# Altium project LV-BMS_21_V2.PrjPcb
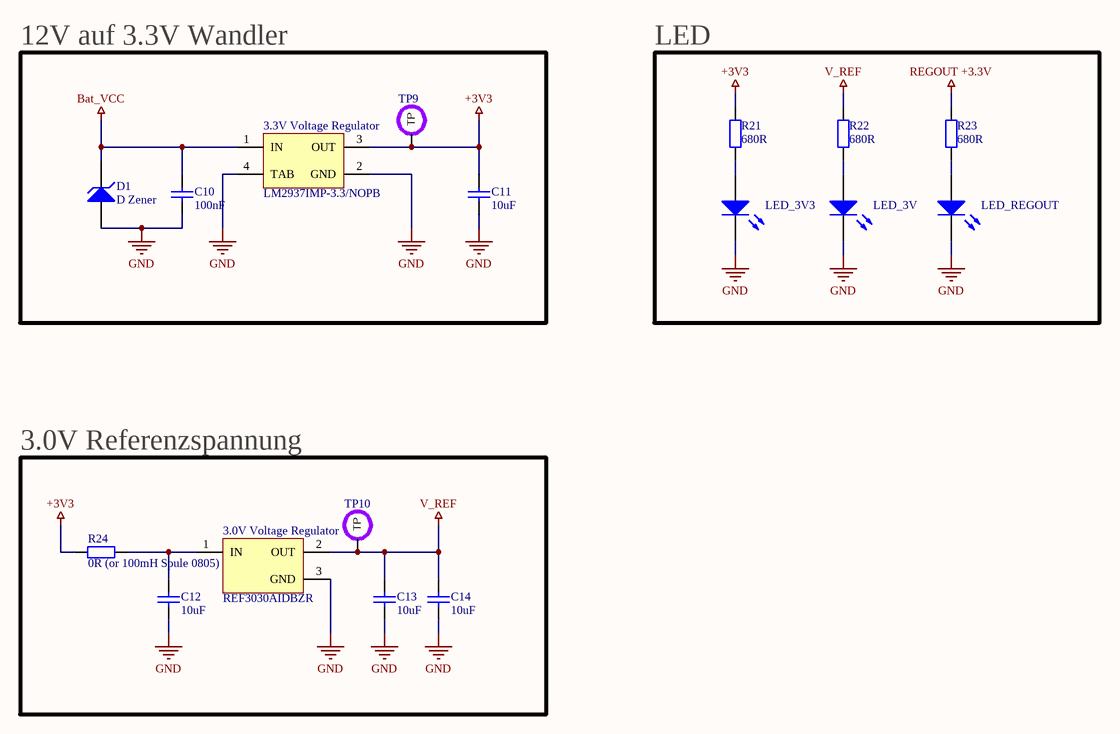
[diagram p0: Power_Supply Voltage.SchDoc]
4 sheets, 163 parts. Net scope: flat (ports and power ports of the same name join across sheets).
Board file: LV-BMS_V2_21E.PcbDoc
Sheets:
  Power_Supply Voltage.SchDoc
  Eingang_Ausgang Signal.SchDoc
  uC.SchDoc
  AFE_BQ-Chip.SchDoc

## Sheet Power_Supply Voltage.SchDoc
size A4

### Parts
3.0V_Voltage_Regulator  REF3030AIDBZR  [DBZ0003A_L]
3.3V_Voltage_Regulator  LM2937IMP-3.3/NOPB  [DCY0004A_M]
C10  100nF  [C1206]
C11  10uF  [1608[0603]]
C12  10uF  [1608[0603]]
C13  10uF  [1608[0603]]
C14  10uF  [1608[0603]]
D1  D Zener  [SMB]
LED_3V  LED_3V  [1608[0603]]  (value not drawn)
LED_3V3  LED_3V3  [1608[0603]]  (value not drawn)
LED_REGOUT  LED_3V  [1608[0603]]  (value not drawn)
R21  680R  [J1-0603]
R22  680R  [J1-0603]
R23  680R  [J1-0603]
R24  0R (or 100mH Spule 0805)  [J1-0603]
TP9  TP_1  [Test point]  (value not drawn)  (no BOM)
TP10  TP_1  [Test point]  (value not drawn)  (no BOM)

### Blocks framed on the sheet
12V auf 3.3V Wandler: 3.3V_Voltage_Regulator C10 C11 D1 TP9
LED: LED_3V LED_3V3 LED_REGOUT R21-R23
3.0V Referenzspannung: 3.0V_Voltage_Regulator C12-C14 R24 TP10

### Nets
+3V3: 3.3V_Voltage_Regulator.3(OUT) C11.2 R21.1 R24.2 TP9.1(TP)
Bat_VCC: 3.3V_Voltage_Regulator.1(IN) C10.2 D1.2(K)
GND: 3.0V_Voltage_Regulator.3(GND) 3.3V_Voltage_Regulator.2(GND) 3.3V_Voltage_Regulator.4(TAB) C10.1 C11.1 C12.1 C13.1 C14.1 D1.1(A) LED_3V.2(K) LED_3V3.2(K) LED_REGOUT.2(K)
REGOUT +3.3V: R23.1
V_REF: 3.0V_Voltage_Regulator.2(OUT) C13.2 C14.2 R22.1 TP10.1(TP)
Net3.0V_Voltage_Regulator_1: 3.0V_Voltage_Regulator.1(IN) C12.2 R24.1
NetLED_3V3_1: LED_3V3.1(A) R21.2
NetLED_3V_1: LED_3V.1(A) R22.2
NetLED_REGOUT_1: LED_REGOUT.1(A) R23.2

### Library data of the parts
3.0V_Voltage_Regulator = CMP-0367-00154-2: 3.0 V, 50 ppm / degC, 50 uA Series (Bandgap) Voltage Reference, -40 to 125 degC, 3-pin SOT-23 (DBZ), Green (RoHS & no Sb/Br); Manufacturer: Texas Instruments; SubFamily: Series Voltage Reference; Temp Coeff(Typ)(ppm/ degree C): 20; Temp Coeff(Max)(ppm/ degree C): 50; Rating: Catalog; ComponentLink2URL: http://www.ti.com/general/docs/lit/getliterature.tsp?genericPartNumber=REF3030&fileType=pdf; DatasheetVersion: SBVS032F; PackageReference: DBZ0003A; PackageDescription: 3-Pin Plastic Small Outline, Body 2.92 x 1.3 mm, Pitch 0.95 mm; ComponentLink1URL: http://www.ti.com/; ComponentLink3Description: Package Specification; PackageVersion: 4203227/B; PartNumber: REF3030AIDBZR; Mounting Technology: Surface Mount; ComponentLink2Description: Datasheet; ComponentLink3URL: http://www.ti.com/litv/pdf/mpds108a; ComponentLink1Description: Manufacturer URL; Code_JEDEC: TO-236; Eco-Plan: Green (RoHS & no Sb/Br)
3.3V_Voltage_Regulator = CMP-0062-01754-3: 400mA and 500mA Voltage Regulator, 4-pin SOT-223, Pb-Free; Manufacturer: Texas Instruments; CompType: LDO IC; PowerWise: N; PackageTopMarking: XYTT*L69B; PackageReference: DCY0004A; PackageDescription: Molded SOT-223, 6.50 x 3.56 x 1.6mm Body, 4 Lead, 2.3mm Pitch; ComponentLink1Description: Datasheet URL; Code_IPC: SOT223-4; ComponentLink1URL: http://www.ti.com/general/docs/lit/getliterature.tsp?genericPartNumber=LM2937-3.3&fileType=pdf; RoHS: Y; PinCount: 4; Code_JEDEC: TO-261-AA
C10-C14 = Cap: Capacitor; Value: 220nF; Published: 8-Jun-2000; LatestRevisionDate: 17-Jul-2002; LatestRevisionNote: Re-released for DXP Platform.; PackageReference: RAD-0.3; Publisher: Altium Limited; PackageDescription: Radial Cap, Thru-Hole; 2 Leads; 0.3 in Pin Spacing
D1 = D Zener: Zener Diode; Published: 8-Jun-2000; LatestRevisionDate: 17-Jul-2002; LatestRevisionNote: Re-released for DXP Platform.; PackageReference: DIODE-0.7; Publisher: Altium Limited; PackageDescription: Diode, Thru-Hole; 2 Leads; 0.7 in Pin Spacing
LED_3V LED_3V3 LED_REGOUT = LED0: Typical INFRARED GaAs LED; Published: 8-Jun-2000; LatestRevisionDate: 08-Jul-2005; LatestRevisionNote: Mech Layer 1 removed.; PackageReference: LED-0; Publisher: Altium Limited; PackageDescription: LED; 2 Leads
R21-R24 = Res2: Resistor; Value: 10kR; Published: 8-Jun-2000; LatestRevisionDate: 17-Jul-2002; LatestRevisionNote: Re-released for DXP Platform.; PackageReference: AXIAL-0.4; Publisher: Altium Limited; PackageDescription: Axial Device, Thru-Hole; 2 Leads; 0.4 in Pin Spacing
TP9 TP10 = Test point

## Sheet Eingang_Ausgang Signal.SchDoc
size A4
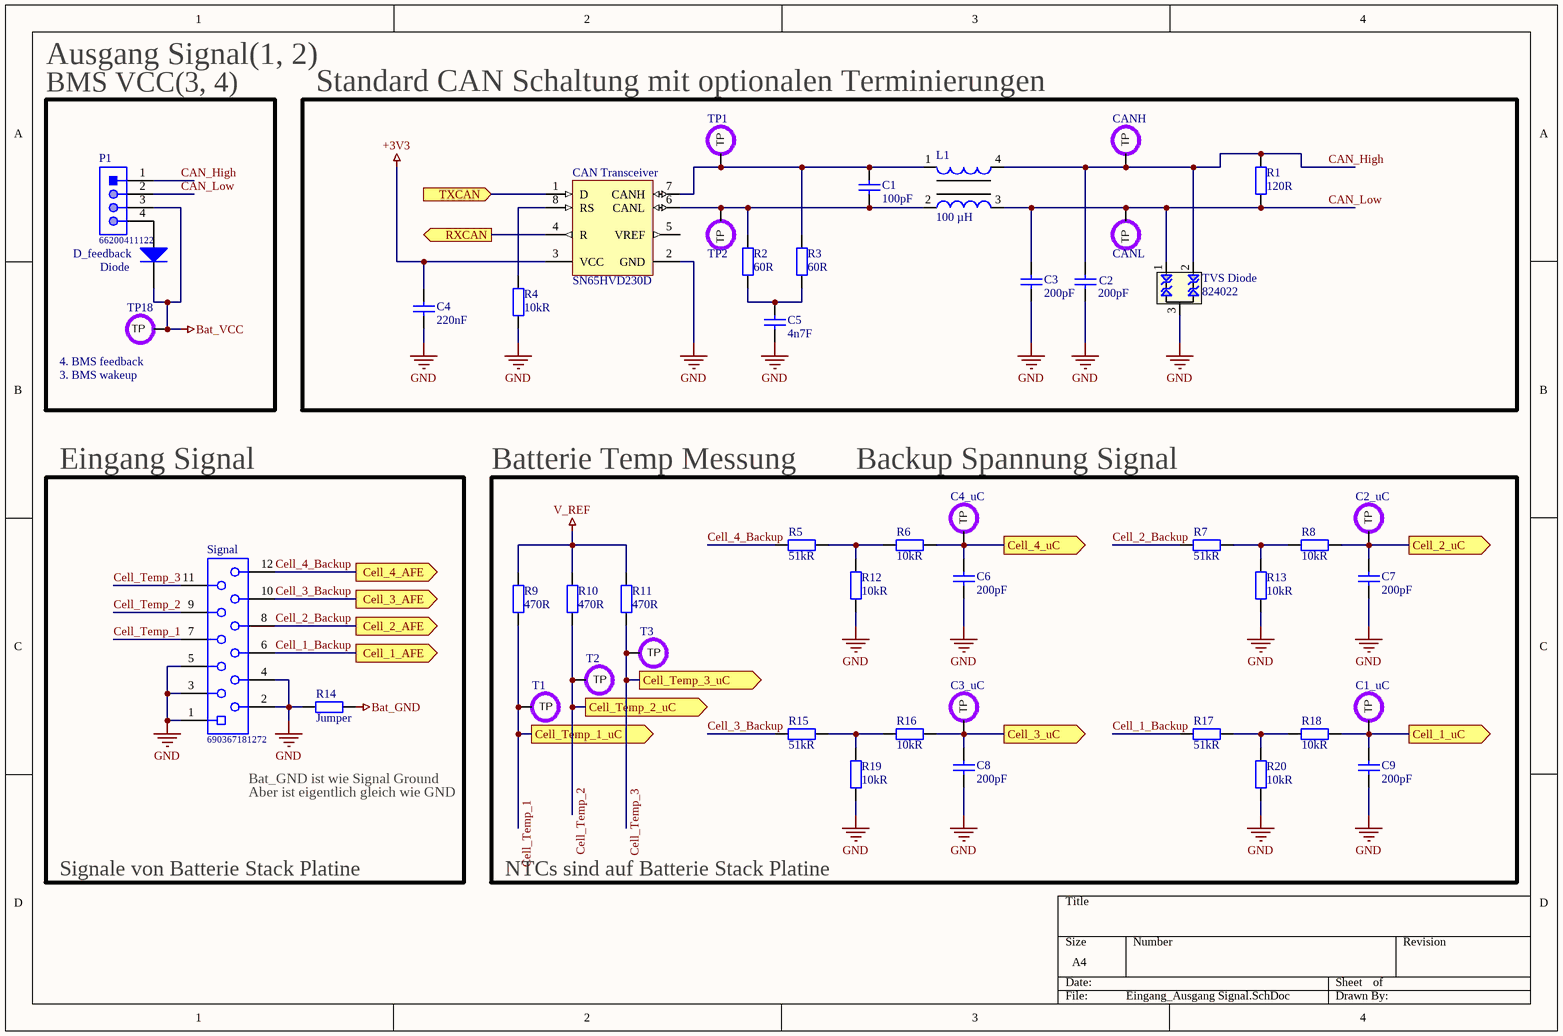
[diagram p1: Eingang_Ausgang Signal.SchDoc]

### Parts
C1  100pF  [1608[0603]]
C1_uC  TP_1  [Test point]  (value not drawn)  (no BOM)
C2  200pF  [1608[0603]]
C2_uC  TP_1  [Test point]  (value not drawn)  (no BOM)
C3  200pF  [1608[0603]]
C3_uC  TP_1  [Test point]  (value not drawn)  (no BOM)
C4  220nF  [1608[0603]]
C4_uC  TP_1  [Test point]  (value not drawn)  (no BOM)
C5  4n7F  [1608[0603]]
C6  200pF  [1608[0603]]
C7  200pF  [1608[0603]]
C8  200pF  [1608[0603]]
C9  200pF  [1608[0603]]
CAN_Transceiver  SN65HVD230D  [D0008A_M]
CANH  TP_1  [Test point]  (value not drawn)  (no BOM)
CANL  TP_1  [Test point]  (value not drawn)  (no BOM)
D_feedback  Diode  [SMB]
L1  100 µH  [WE-SLM]
P1  66200411122  [66200411122]
R1  120R  [J1-0603]
R2  60R  [J1-0603]
R3  60R  [J1-0603]
R4  10kR  [J1-0603]
R5  51kR  [J1-0603]
R6  10kR  [J1-0603]
R7  51kR  [J1-0603]
R8  10kR  [J1-0603]
R9  470R  [J1-0603]
R10  470R  [J1-0603]
R11  470R  [J1-0603]
R12  10kR  [J1-0603]
R13  10kR  [J1-0603]
R14  Jumper  [J1-0603]
R15  51kR  [J1-0603]
R16  10kR  [J1-0603]
R17  51kR  [J1-0603]
R18  10kR  [J1-0603]
R19  10kR  [J1-0603]
R20  10kR  [J1-0603]
Signal  690367181272  [690367181272]
T1  TP_1  [Test point]  (value not drawn)  (no BOM)
T2  TP_1  [Test point]  (value not drawn)  (no BOM)
T3  TP_1  [Test point]  (value not drawn)  (no BOM)
TP1  TP_1  [Test point]  (value not drawn)  (no BOM)
TP2  TP_1  [Test point]  (value not drawn)  (no BOM)
TP18  TP_1  [Test point]  (value not drawn)  (no BOM)
TVS_Diode  824022  [SOT23_3L]

### Blocks framed on the sheet
BMS VCC(3, 4): D_feedback P1 TP18
Standard CAN Schaltung mit optionalen Terminierungen: C1-C5 CAN_Transceiver CANH CANL L1 R1-R4 TP1 TP2 TVS_Diode
Eingang Signal: R14 Signal

### Ports
Cell_1_AFE (out), Cell_1_uC (out), Cell_2_AFE (out), Cell_2_uC (out), Cell_3_AFE (out), Cell_3_uC (out), Cell_4_AFE (out), Cell_4_uC (out), Cell_Temp_1_uC (out), Cell_Temp_2_uC (out), Cell_Temp_3_uC (out), RXCAN (out), TXCAN (in)

### Nets
+3V3: C4.2 CAN_Transceiver.3(VCC)
Bat_GND: R14.1
Bat_VCC: D_feedback.2(K) P1.3 TP18.1(TP)
GND: C2.1 C3.1 C4.1 C5.1 C6.1 C7.1 C8.1 C9.1 CAN_Transceiver.2(GND) R4.1 R12.1 R13.1 R14.2 R19.1 R20.1 Signal.1 Signal.2 Signal.3 Signal.4 Signal.5 TVS_Diode.3(GND)
V_REF: R9.2 R10.2 R11.2
CAN_High: C2.2 CANH.1(TP) L1.4 P1.1 R1.2 TVS_Diode.2(I/O)
CAN_Low: C3.2 CANL.1(TP) L1.3 P1.2 R1.1 TVS_Diode.1(I/O)
Cell_1_Backup: R17.2 Signal.6 ; port Cell_1_AFE  [project net Cell_1_AFE]
Cell_2_Backup: R7.2 Signal.8 ; port Cell_2_AFE
Cell_3_Backup: R15.2 Signal.10 ; port Cell_3_AFE
Cell_4_Backup: R5.2 Signal.12 ; port Cell_4_AFE
Cell_Temp_1: R9.1 Signal.7 T1.1(TP) ; port Cell_Temp_1_uC
Cell_Temp_2: R10.1 Signal.9 T2.1(TP) ; port Cell_Temp_2_uC
Cell_Temp_3: R11.1 Signal.11 T3.1(TP) ; port Cell_Temp_3_uC
NetC1_1: C1.1 CAN_Transceiver.6(CANL) L1.2 R2.2 TP2.1(TP)
NetC1_2: C1.2 CAN_Transceiver.7(CANH) L1.1 R3.2 TP1.1(TP)
NetC1_uC_1: C1_uC.1(TP) C9.2 R18.1 ; port Cell_1_uC
NetC2_uC_1: C2_uC.1(TP) C7.2 R8.1 ; port Cell_2_uC
NetC3_uC_1: C3_uC.1(TP) C8.2 R16.1 ; port Cell_3_uC
NetC4_uC_1: C4_uC.1(TP) C6.2 R6.1 ; port Cell_4_uC
NetC5_2: C5.2 R2.1 R3.1
NetCAN_Transceiver_1: CAN_Transceiver.1(D) ; port TXCAN
NetCAN_Transceiver_4: CAN_Transceiver.4(R) ; port RXCAN
NetCAN_Transceiver_8: CAN_Transceiver.8(RS) R4.2
NetD_feedback_1: D_feedback.1(A) P1.4
NetR5_1: R5.1 R6.2 R12.2
NetR7_1: R7.1 R8.2 R13.2
NetR15_1: R15.1 R16.2 R19.2
NetR17_1: R17.1 R18.2 R20.2

Not connected (* = marked no-connect by the designer): CAN_Transceiver 5(VREF)

### Notes on the sheet
- Ausgang Signal(1, 2)
- (near TP18) 4. BMS feedback
- (near TP18) 3. BMS wakeup
- Batterie Temp Messung
- Backup Spannung Signal
- Bat_GND ist wie Signal Ground
- Aber ist eigentlich gleich wie GND
- Signale von Batterie Stack Platine
- NTCs sind auf Batterie Stack Platine

### Library data of the parts
C1 C4 = Cap: Capacitor; Published: 8-Jun-2000; LatestRevisionDate: 17-Jul-2002; LatestRevisionNote: Re-released for DXP Platform.; PackageReference: RAD-0.3; Publisher: Altium Limited; PackageDescription: Radial Cap, Thru-Hole; 2 Leads; 0.3 in Pin Spacing
  C1: Value: 100pF
  C4: Value: 220nF
C1_uC C2_uC C3_uC C4_uC CANH CANL T1-T3 TP1 TP2 TP18 = Test point
C2 C3 C5-C9 = Cap: Capacitor; Value: 220nF; Published: 8-Jun-2000; LatestRevisionDate: 17-Jul-2002; LatestRevisionNote: Re-released for DXP Platform.; PackageReference: RAD-0.3; Publisher: Altium Limited; PackageDescription: Radial Cap, Thru-Hole; 2 Leads; 0.3 in Pin Spacing
CAN_Transceiver = CMP-0315-00046-3: CAN Bus Transceiver, 3.3 V, -40 to 85 degC, 8-Pin SOIC (D), Green (RoHS & no Sb/Br), Tube; Supply Voltage Min: 3 V; Supply Voltage Max: 3.6 V; PartNumber: SN65HVD230D; ComponentLink2URL: http://www.ti.com/general/docs/lit/getliterature.tsp?genericGeneric Part Number=SN65HVD230&fileType=pdf; DatasheetVersion: SLOS346N; Generic Part Number: SN65HVD230; Packing: Tube; Temperature Min: -40 degC; Temperature Max: 85 degC; ComponentLink1Description: Manufacturer URL; Mounting Technology: Surface Mount; RoHS: TRUE; ComponentLink1URL: http://www.ti.com/; ComponentLink2Description: Datasheet; PackageDescription: 8-Pin Plastic Small Outline, Body 4.9 x 3.9 mm, Pitch 1.27 mm
D_feedback = Diode: Default Diode; Published: 8-Jun-2000; LatestRevisionDate: 17-Jul-2002; LatestRevisionNote: Re-released for DXP Platform.; PackageVersion: Sep-1996; PackageReference: SMC; Publisher: Altium Limited; PackageDescription: DO-214-AB/SMC; 2 C-Bend Leads; Body 7.9 x 5.9 mm, inc. leads (LxW); Code_JEDEC: DO-214-AB
L1 = CMP-0222-00021-1: SMD Common Mode Line Filter WE-SLM, L = 100 µH; Inductance: 100 ÂµH; ComponentLink1Description: Manufacturer Link; ComponentLink2URL: http://www.we-online.de/katalog/media/pdf/744242101.pdf; PackageVersion: 2006; PackageReference: WE-SLM; PackageDescription: SMD Inductor, 4-Leads, Body 3.6 x 6.3 mm; ComponentLink1URL: http://www.we-online.com; ComponentLink2Description: Datasheet; DatasheetVersion: ver 3, Feb-2006
P1 = CMP-1502-00442-1: THT Male Header WR-MPC3, Vertical, Single Row, pitch 3 mm, 4 pins; Manufacturer: Wurth Elektronik; Contact Resistance: 10mOhm; Working Voltage: 250VAC; Pin Number: 4; Pitch: 3mm; Manufacturer URL: http://www.we-online.de; Package Reference: 66200411122; Packaging: Tube; Part Number: 66200411122; Publisher: WurthElektronik; Orientation: Vertical; Mounting Technology: THT; Gender: Male; Operating Temperature: -40to105degC; Datasheet URL: https://katalog.we-online.de/em/datasheet/6620xx11122.pdf
R1-R3 R5 R7 R9-R11 R14 R15 R17 = Res2: Resistor; Value: 10kR; Published: 8-Jun-2000; LatestRevisionDate: 17-Jul-2002; LatestRevisionNote: Re-released for DXP Platform.; PackageReference: AXIAL-0.4; Publisher: Altium Limited; PackageDescription: Axial Device, Thru-Hole; 2 Leads; 0.4 in Pin Spacing
R4 R6 R8 R12 R13 R16 R18-R20 = Res2: Resistor; Published: 8-Jun-2000; LatestRevisionDate: 17-Jul-2002; LatestRevisionNote: Re-released for DXP Platform.; PackageReference: AXIAL-0.4; Publisher: Altium Limited; PackageDescription: Axial Device, Thru-Hole; 2 Leads; 0.4 in Pin Spacing; Value: 10kR
Signal = CMP-1502-00845-1: Female THT Straight Connector without Latch and without Polarization WR-MM, 12 pins; Manufacturer: Wurth Elektronik; Working Voltage: 100VAC; Withstanding Voltage: 500VAC; Contact Resistance: 10mOhm; Pin Number: 12; Insulation Resistance: >1000MOhm; Pitch: 2.54mm; Rated Current: 1.5A; Datasheet URL: https://katalog.we-online.de/em/datasheet/690367181272.pdf; Package Reference: 690367181272; Packaging: Tube; Operating Temperature: -40to105degC; Part Number: 690367181272; Gender: Female; Publisher: WurthElektronik; Mounting Technology: THT; Manufacturer URL: http://www.we-online.de
TVS_Diode = CMP-1485-00002-1: TVS Diode WE-TVS-Standard, VRWM=5.0V; Manufacturer: Wuerth Elektronik; Reverse Stand Off Voltage: 5V; ComponentLink1Description: Manufacturer URL; ComponentLink2Description: Datasheet; PackageReference: SOT23_3L; PartNumber: 824022; ComponentLink1URL: http://www.we-online.com; ComponentLink2URL: http://katalog.we-online.de/kataloge/eisos/media/pdf/824022.pdf

## Sheet uC.SchDoc
size A4
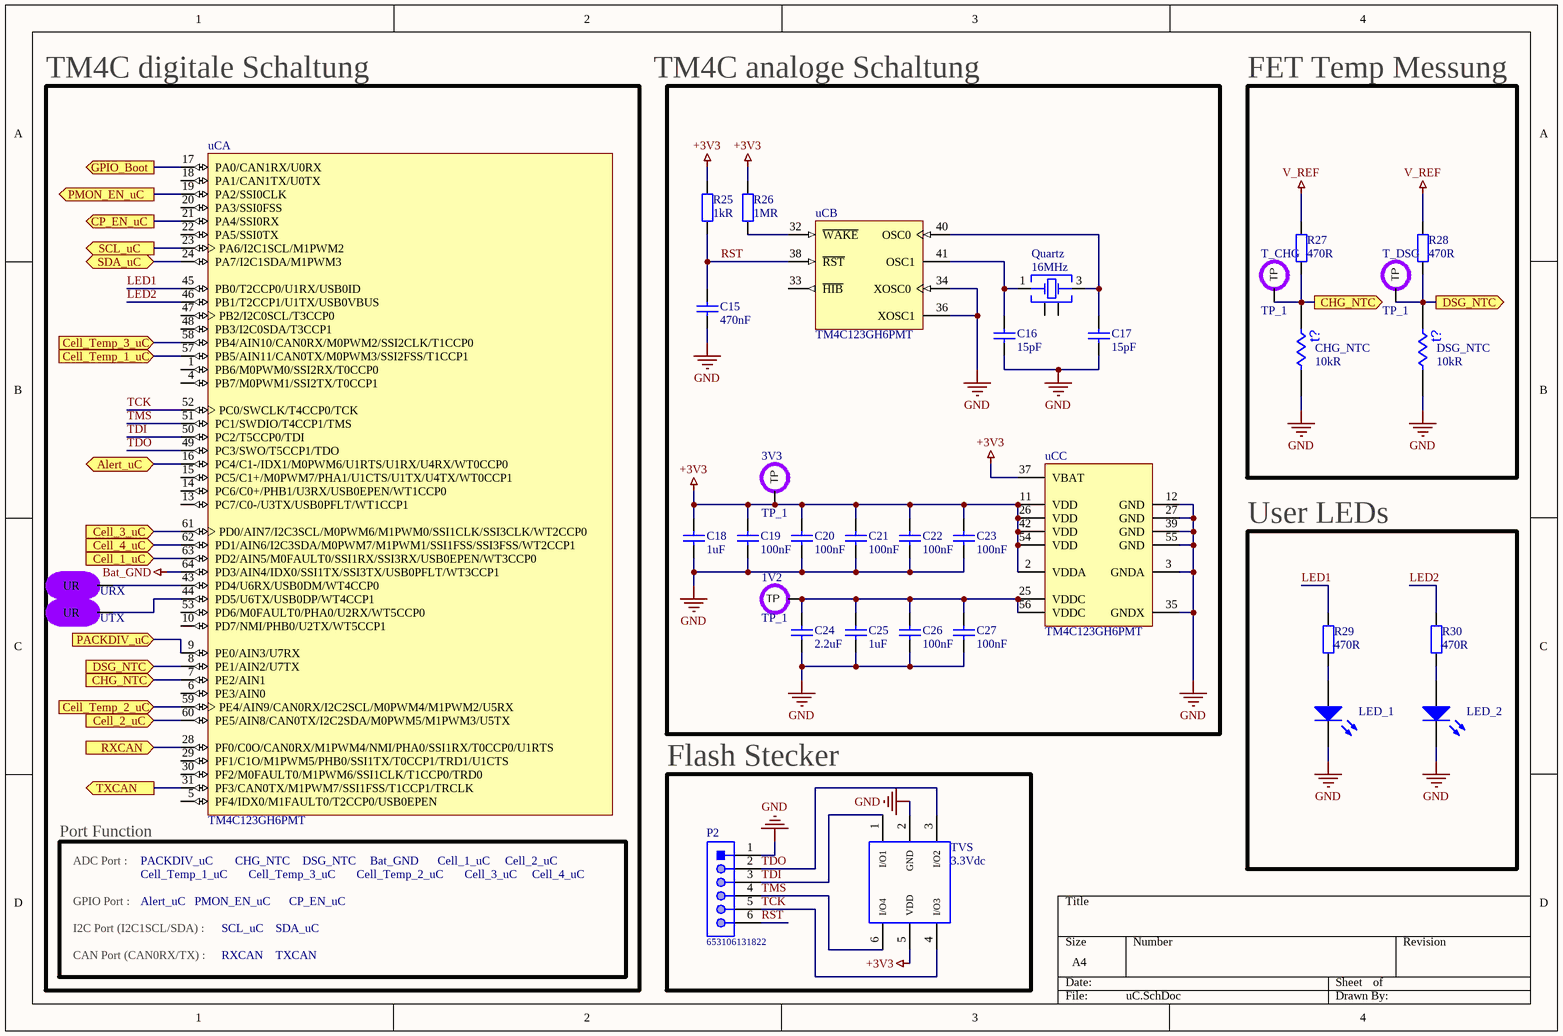
[diagram p2: uC.SchDoc]

### Parts
1V2  TP_1  [Test point]  (no BOM)
3V3  TP_1  [Test point]  (no BOM)
C15  470nF  [1608[0603]]
C16  15pF  [1608[0603]]
C17  15pF  [1608[0603]]
C18  1uF  [1608[0603]]
C19  100nF  [1608[0603]]
C20  100nF  [1608[0603]]
C21  100nF  [1608[0603]]
C22  100nF  [1608[0603]]
C23  100nF  [1608[0603]]
C24  2.2uF  [1608[0603]]
C25  1uF  [1608[0603]]
C26  100nF  [1608[0603]]
C27  100nF  [1608[0603]]
CHG_NTC  10kR  [J1-0603]
DSG_NTC  10kR  [J1-0603]
LED_1  (no value)  [1608[0603]]
LED_2  (no value)  [1608[0603]]
P2  653106131822  [653106131822]
Quartz  16MHz  [WE-XTAL_CFPX-180]
R25  1kR  [J1-0603]
R26  1MR  [J1-0603]
R27  470R  [J1-0603]
R28  470R  [J1-0603]
R29  470R  [J1-0603]
R30  470R  [J1-0603]
T_CHG  TP_1  [Test point]  (no BOM)
T_DSG  TP_1  [Test point]  (no BOM)
TVS  3.3Vdc  [WE-TVS_SOT23-6L]
uC  TM4C123GH6PMT  [PM0064A_L]  (parts A,B,C of 3)
URX  UR  [UR Pad]  (value not drawn)
UTX  UR  [UR Pad]  (value not drawn)

### Blocks framed on the sheet
TM4C digitale Schaltung: uC URX UTX
FET Temp Messung: CHG_NTC DSG_NTC R27 R28 T_CHG T_DSG
User LEDs: LED_1 LED_2 R29 R30
Flash Stecker: P2 TVS

### Ports
Alert_uC (bidir), Cell_1_uC (in), Cell_2_uC (in), Cell_3_uC (in), Cell_4_uC (in), Cell_Temp_1_uC (in), Cell_Temp_2_uC (in), Cell_Temp_3_uC (in), CHG_NTC (in), CHG_NTC (out), CP_EN_uC (out), DSG_NTC (in), DSG_NTC (out), GPIO_Boot (out), PACKDIV_uC (in), PMON_EN_uC (out), RXCAN (in), SCL_uC (out), SDA_uC (bidir), TXCAN (out)

### Nets
+3V3: 3V3.1(TP) C18.1 C19.1 C20.1 C21.1 C22.1 C23.1 R25.1 R26.1 TVS.5(VDD) uC.2(VDDA) uC.11(VDD) uC.26(VDD) uC.37(VBAT) uC.42(VDD) uC.54(VDD)
Bat_GND: uC.64(PD3/AIN4/IDX0/SSI1TX/SSI3TX/USB0PFLT/WT3CCP1)
GND: C15.2 C16.2 C17.2 C18.2 C19.2 C20.2 C21.2 C22.2 C23.2 C24.2 C25.2 C26.2 C27.2 CHG_NTC.2 DSG_NTC.2 LED_1.2(K) LED_2.2(K) P2.1 TVS.2(GND) uC.3(GNDA) uC.12(GND) uC.27(GND) uC.34(XOSC0) uC.35(GNDX) uC.36(XOSC1) uC.39(GND) uC.55(GND)
V_REF: R27.1 R28.1
Cell_Temp_1: uC.57(PB5/AIN11/CAN0TX/M0PWM3/SSI2FSS/T1CCP1) ; port Cell_Temp_1_uC
Cell_Temp_2: uC.59(PE4/AIN9/CAN0RX/I2C2SCL/M0PWM4/M1PWM2/U5RX) ; port Cell_Temp_2_uC
Cell_Temp_3: uC.58(PB4/AIN10/CAN0RX/M0PWM2/SSI2CLK/T1CCP0) ; port Cell_Temp_3_uC
LED1: R29.1 uC.45(PB0/T2CCP0/U1RX/USB0ID)
LED2: R30.1 uC.46(PB1/T2CCP1/U1TX/USB0VBUS)
RST: C15.1 P2.6 R25.2 uC.38(~{RST})
TCK: P2.5 TVS.4(I/O3) uC.52(PC0/SWCLK/T4CCP0/TCK)
TDI: P2.3 TVS.1(I/O1) uC.50(PC2/T5CCP0/TDI)
TDO: P2.2 TVS.3(I/O2) uC.49(PC3/SWO/T5CCP1/TDO)
TMS: P2.4 TVS.6(I/O4) uC.51(PC1/SWDIO/T4CCP1/TMS)
TP_SCL: uC.23(PA6/I2C1SCL/M1PWM2) ; port SCL_uC
TP_SDA: uC.24(PA7/I2C1SDA/M1PWM3) ; port SDA_uC
Net1V2_1: 1V2.1(TP) C24.1 C25.1 C26.1 C27.1 uC.25(VDDC) uC.56(VDDC)
NetBQ_20: uC.16(PC4/C1-/IDX1/M0PWM6/U1RTS/U1RX/U4RX/WT0CCP0) ; port Alert_uC
NetC1_uC_1: uC.63(PD2/AIN5/M0FAULT0/SSI1RX/SSI3RX/USB0EPEN/WT3CCP0) ; port Cell_1_uC
NetC2_uC_1: uC.60(PE5/AIN8/CAN0TX/I2C2SDA/M0PWM5/M1PWM3/U5TX) ; port Cell_2_uC
NetC3_uC_1: uC.61(PD0/AIN7/I2C3SCL/M0PWM6/M1PWM0/SSI1CLK/SSI3CLK/WT2CCP0) ; port Cell_3_uC
NetC4_uC_1: uC.62(PD1/AIN6/I2C3SDA/M0PWM7/M1PWM1/SSI1FSS/SSI3FSS/WT2CCP1) ; port Cell_4_uC
NetC16_1: C16.1 Quartz.1(Crystal) uC.41(OSC1)
NetC17_1: C17.1 Quartz.3(Crystal) uC.40(OSC0)
NetCAN_Transceiver_1: uC.31(PF3/CAN0TX/M1PWM7/SSI1FSS/T1CCP1/TRCLK) ; port TXCAN
NetCAN_Transceiver_4: uC.28(PF0/C0O/CAN0RX/M1PWM4/NMI/PHA0/SSI1RX/T0CCP0/U1RTS) ; port RXCAN
NetCHG_NTC_1: CHG_NTC.1 R27.2 T_CHG.1(TP) uC.7(PE2/AIN1) ; port CHG_NTC
NetDSG_NTC_1: DSG_NTC.1 R28.2 T_DSG.1(TP) uC.8(PE1/AIN2/U7TX) ; port DSG_NTC
NetLED_1_1: LED_1.1(A) R29.2
NetLED_2_1: LED_2.1(A) R30.2
NetNFET_driver_5: uC.21(PA4/SSI0RX) ; port CP_EN_uC
NetNFET_driver_7: uC.19(PA2/SSI0CLK) ; port PMON_EN_uC
NetR26_2: R26.2 uC.32(~{WAKE})
NetR43_1: uC.17(PA0/CAN1RX/U0RX) ; port GPIO_Boot
NetR48_1: uC.9(PE0/AIN3/U7RX) ; port PACKDIV_uC
NetuC_43: uC.43(PD4/U6RX/USB0DM/WT4CCP0) URX.1(UR)
NetuC_44: uC.44(PD5/U6TX/USB0DP/WT4CCP1) UTX.1(UR)

Not connected (* = marked no-connect by the designer): Quartz 2(GND) 4(GND); uC 1(PB6/M0PWM0/SSI2RX/T0CCP0) 4(PB7/M0PWM1/SSI2TX/T0CCP1) 5(PF4/IDX0/M1FAULT0/T2CCP0/USB0EPEN) 6(PE3/AIN0) 10(PD7/NMI/PHB0/U2TX/WT5CCP1) 13(PC7/C0-/U3TX/USB0PFLT/WT1CCP1) 14(PC6/C0+/PHB1/U3RX/USB0EPEN/WT1CCP0) 15(PC5/C1+/M0PWM7/PHA1/U1CTS/U1TX/U4TX/WT0CCP1) 18(PA1/CAN1TX/U0TX) 20(PA3/SSI0FSS) 22(PA5/SSI0TX) 29(PF1/C1O/M1PWM5/PHB0/SSI1TX/T0CCP1/TRD1/U1CTS) 30(PF2/M0FAULT0/M1PWM6/SSI1CLK/T1CCP0/TRD0) 33(~{HIB}) 47(PB2/I2C0SCL/T3CCP0) 48(PB3/I2C0SDA/T3CCP1) 53(PD6/M0FAULT0/PHA0/U2RX/WT5CCP0)

### Notes on the sheet
- TM4C analoge Schaltung
- (near uC) Port Function
- GPIO Port :
- ADC Port :
- PACKDIV_uC
- Cell_Temp_1_uC
- Alert_uC
- PMON_EN_uC
- CHG_NTC
- Cell_Temp_3_uC
- CP_EN_uC
- DSG_NTC
- Cell_Temp_2_uC
- Bat_GND
- Cell_1_uC
- Cell_3_uC
- Cell_2_uC
- Cell_4_uC
- I2C Port (I2C1SCL/SDA) :
- CAN Port (CAN0RX/TX) :
- RXCAN
- SCL_uC
- TXCAN
- SDA_uC
- (in symbol Res Thermal) t?

### Library data of the parts
1V2 = Test point: Power Supply for logical circuit
3V3 = Test point: Power Supply for uC
C15-C27 = Cap: Capacitor; Value: 220nF; Published: 8-Jun-2000; LatestRevisionDate: 17-Jul-2002; LatestRevisionNote: Re-released for DXP Platform.; PackageReference: RAD-0.3; Publisher: Altium Limited; PackageDescription: Radial Cap, Thru-Hole; 2 Leads; 0.3 in Pin Spacing
CHG_NTC DSG_NTC = Res Thermal: Thermistor; Published: 24-Mar-1999; LatestRevisionDate: 29-May-2009; LatestRevisionNote: IPC-7351 Footprint Added.; PackageVersion: Mar-2003; PackageReference: 6-0805; Publisher: Altium Limited; PackageDescription: Chip Resistor 0805 Case Size; Code_IPC: RESC2012
LED_1 LED_2 = LED0: Typical INFRARED GaAs LED; Published: 8-Jun-2000; LatestRevisionDate: 08-Jul-2005; LatestRevisionNote: Mech Layer 1 removed.; PackageReference: LED-0; Publisher: Altium Limited; PackageDescription: LED; 2 Leads
P2 = CMP-1502-00775-1: Male Shrouded Header WR-WTB, SMT, Right Angled, pitch 1.25 mm, 1 x 6 position; Manufacturer: Wurth Elektronik; Position: 1x6; Pitch: 1.25mm; Contact Resistance: 20mOhm; Working Voltage: 125VAC; Publisher: WurthElektronik; Package Reference: 653106131822; Operating Temperature: -40to85degC; Orientation: RightAngled; Mounting Technology: SMT; Manufacturer URL: http://www.we-online.de; Gender: Male; Packaging: TapeandReel; Part Number: 653106131822; Datasheet URL: https://katalog.we-online.de/em/datasheet/6531xx131822.pdf
Quartz = 830108207109: WE-XTAL Quartz Crystal, SMT, CFPX-180, 16MHz, +/-10ppm; Manufacturer: Wurth Elektronik; Frequency Stability: +/-20ppm; Load Capacitance: 8pF; ComponentLink1Description: Manufacturer; ComponentLink1URL: http://www.we-online.de; ComponentLink2Description: Datasheet; ComponentLink2URL: https://katalog.we-online.com/pbs/datasheet/830108207109.pdf; Operating Temperature: -40 to +85degC; Packaging: Tape and Reel; Manufacturer Part Number: 830108207109; Published Date: July 2020; Size: CFPX-180; Frequency: 16MHz; Frequency Tolerance: +/-10ppm; Mounting Technology: SMT
R25-R30 = Res2: Resistor; Value: 10kR; Published: 8-Jun-2000; LatestRevisionDate: 17-Jul-2002; LatestRevisionNote: Re-released for DXP Platform.; PackageReference: AXIAL-0.4; Publisher: Altium Limited; PackageDescription: Axial Device, Thru-Hole; 2 Leads; 0.4 in Pin Spacing
T_CHG T_DSG = Test point
TVS = 824013: WE-TVS TVS Diode - High Speed Series, SOT23-6L, 4+1Channel, 3.3Vdc; Manufacturer: Wurth Elektronik; Reverse Breakdown Voltage min.: 4.5V; Channel: 4+1; Channel Input Capacitance: 3pF; Reverse Peak Pulse Current: 12A; Reverse Channel Leakage Current: 5uA; DC Operating Voltage: 3.3V; ComponentLink1Description: Manufacturer; ComponentLink1URL: http://www.we-online.de; ComponentLink2Description: Datasheet; ComponentLink2URL: https://www.we-online.com/catalog/datasheet/824013.pdf; Manufacturer Part Number: 824013; Published Date: April 2020; Size: SOT23-6L; Operating Temperature: -40 to +125degC; Mounting Technology: SMT; Packaging: Tape and Reel
uC = CMP-0945-00001-2: Tiva C Series Microcontroller, 256 KB Flash, 32 KB SRAM, 12 Bit, 12 Channels, -40 to 105 degC, 64-Pin LQFP (PM), Green (RoHS & no Sb/Br); Manufacturer: Texas Instruments; Tiva Series: Connected MCUs; Prefix: Qualified Device; I2C: 2; Max Speed: 80 MHz; GPIOs: 43; ADC Resolution: 12 Bit; Program Memory: 256 KB; UART: 4; Data Memory: 32 KB; ADC Channels: 12; ComponentLink2URL: http://www.ti.com/lit/ds/symlink/tm4c123gh6pm.pdf; ComponentLink1URL: http://www.ti.com/; ComponentLink2Description: Datasheet; PackageVersion: 4040152/C; ComponentLink3URL: http://www.ti.com/litv/pdf/mtqf008a; Temperature Range: -40 to 105 degC; Mounting Technology: Surface Mount; RoHS: TRUE; DatasheetVersion: Rev. 15741.2722; PackageReference: PM0064A; ComponentLink1Description: Manufacturer URL; PartNumber: TM4C123GH6PMT; PackageDescription: 64-Pin Plastic Quad Flatpack, Body 10 x 10 mm, Pitch 0.5 mm; ComponentLink3Description: Package Specification
URX UTX = UR Pad

## Sheet AFE_BQ-Chip.SchDoc
size A4
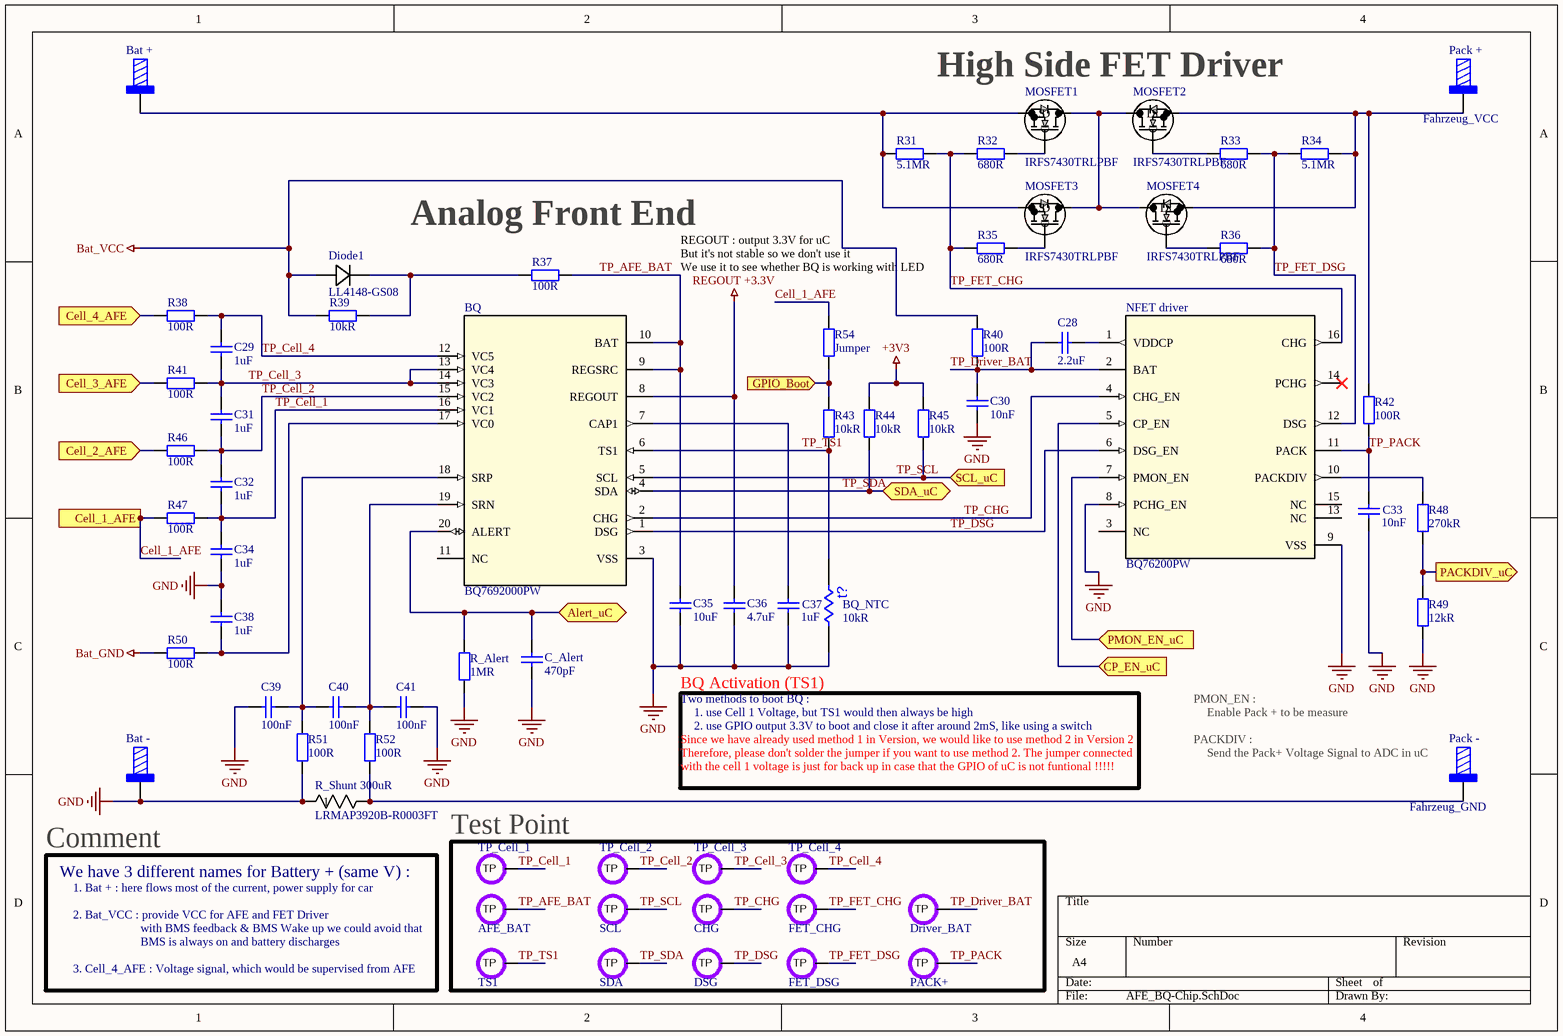
[diagram p3: AFE_BQ-Chip.SchDoc]

### Parts
AFE_BAT  TP_1  [Test point]  (value not drawn)  (no BOM)
Bat_+  M4x6mm  [7461096_for chemical surfaces]  (value not drawn)
Bat_-  M4x6mm  [7461096_for chemical surfaces]  (value not drawn)
BQ  BQ7692000PW  [PW0020A_N]
BQ_NTC  10kR  [J1-0603]
C28  2.2uF  [1608[0603]]
C29  1uF  [1608[0603]]
C30  10nF  [1608[0603]]
C31  1uF  [1608[0603]]
C32  1uF  [1608[0603]]
C33  10nF  [1608[0603]]
C34  1uF  [1608[0603]]
C35  10uF  [1608[0603]]
C36  4.7uF  [1608[0603]]
C37  1uF  [1608[0603]]
C38  1uF  [1608[0603]]
C39  100nF  [1608[0603]]
C40  100nF  [1608[0603]]
C41  100nF  [1608[0603]]
C_Alert  470pF  [1608[0603]]
CHG  TP_1  [Test point]  (value not drawn)  (no BOM)
Diode1  LL4148-GS08  [MELF_SOD-80_VIS]
Driver_BAT  TP_1  [Test point]  (value not drawn)  (no BOM)
DSG  TP_1  [Test point]  (value not drawn)  (no BOM)
FET_CHG  TP_1  [Test point]  (value not drawn)  (no BOM)
FET_DSG  TP_1  [Test point]  (value not drawn)  (no BOM)
MOSFET1  IRFS7430TRLPBF  [D2PAK_TO-263AB_INF-M]
MOSFET2  IRFS7430TRLPBF  [D2PAK_TO-263AB_INF-M]
MOSFET3  IRFS7430TRLPBF  [D2PAK_TO-263AB_INF-M]
MOSFET4  IRFS7430TRLPBF  [D2PAK_TO-263AB_INF-M]
NFET_driver  BQ76200PW  [PW0016A_L]
PACK+  TP_1  [Test point]  (value not drawn)  (no BOM)
Pack_+  Fahrzeug_VCC  [7461096_for chemical surfaces]
Pack_-  Fahrzeug_GND  [7461096_for chemical surfaces]
R31  5.1MR  [J1-0603]
R32  680R  [J1-0603]
R33  680R  [J1-0603]
R34  5.1MR  [J1-0603]
R35  680R  [J1-0603]
R36  680R  [J1-0603]
R37  100R  [J1-0603]
R38  100R  [J1-0603]
R39  10kR  [J1-0603]
R40  100R  [J1-0603]
R41  100R  [J1-0603]
R42  100R  [J1-0603]
R43  10kR  [J1-0603]
R44  10kR  [J1-0603]
R45  10kR  [J1-0603]
R46  100R  [J1-0603]
R47  100R  [J1-0603]
R48  270kR  [J1-0603]
R49  12kR  [J1-0603]
R50  100R  [J1-0603]
R51  100R  [J1-0603]
R52  100R  [J1-0603]
R54  Jumper  [J1-0603]
R_Alert  1MR  [J1-0603]
R_Shunt_300uR  LRMAP3920B-R0003FT  [RES_LRMAP3920B-R0003FT_WEL]
SCL  TP_1  [Test point]  (value not drawn)  (no BOM)
SDA  TP_1  [Test point]  (value not drawn)  (no BOM)
TP_Cell_1  TP_1  [Test point]  (value not drawn)  (no BOM)
TP_Cell_2  TP_1  [Test point]  (value not drawn)  (no BOM)
TP_Cell_3  TP_1  [Test point]  (value not drawn)  (no BOM)
TP_Cell_4  TP_1  [Test point]  (value not drawn)  (no BOM)
TS1  TP_1  [Test point]  (value not drawn)  (no BOM)

### Blocks framed on the sheet
Test Point: AFE_BAT CHG Driver_BAT DSG FET_CHG FET_DSG PACK+ SCL SDA TP_Cell_1-TP_Cell_4 TS1

### Ports
Alert_uC (bidir), Cell_1_AFE (in), Cell_2_AFE (in), Cell_3_AFE (in), Cell_4_AFE (in), CP_EN_uC (in), GPIO_Boot (in), PACKDIV_uC (out), PMON_EN_uC (in), SCL_uC (in), SDA_uC (bidir)

### Nets
+3V3: R44.1 R45.1
Bat_GND: R50.2
Bat_VCC: Diode1.2 R39.2 R40.1
GND: Bat_-.1 BQ.3(VSS) BQ_NTC.2 C30.1 C33.2 C34.1 C35.2 C36.2 C37.2 C38.1 C39.2 C41.1 C_Alert.2 NFET_driver.8(PCHG_EN) NFET_driver.9(VSS) R49.1 R51.2 R_Alert.2 R_Shunt_300uR.1
REGOUT +3.3V: BQ.8(REGOUT) C36.1
Cell_1_AFE: R47.2 R54.2 ; port Cell_1_AFE
Cell_2_Backup: R46.2 ; port Cell_2_AFE
Cell_3_Backup: R41.2 ; port Cell_3_AFE
Cell_4_Backup: R38.2 ; port Cell_4_AFE
TP_AFE_BAT: AFE_BAT.1(TP) BQ.9(REGSRC) BQ.10(BAT) C35.1 R37.1
TP_Cell_1: BQ.16(VC1) C32.1 C34.2 R47.1 TP_Cell_1.1(TP)
TP_Cell_2: BQ.15(VC2) C31.1 C32.2 R46.1 TP_Cell_2.1(TP)
TP_Cell_3: BQ.13(VC4) BQ.14(VC3) C29.1 C31.2 R41.1 TP_Cell_3.1(TP)
TP_Cell_4: BQ.12(VC5) C29.2 R38.1 TP_Cell_4.1(TP)
TP_CHG: BQ.2(CHG) CHG.1(TP) NFET_driver.4(CHG_EN)
TP_Driver_BAT: C28.2 C30.2 Driver_BAT.1(TP) NFET_driver.2(BAT) R40.2
TP_DSG: BQ.1(DSG) DSG.1(TP) NFET_driver.6(DSG_EN)
TP_FET_CHG: FET_CHG.1(TP) NFET_driver.16(CHG) R31.2 R32.1 R35.1
TP_FET_DSG: FET_DSG.1(TP) NFET_driver.12(DSG) R33.2 R34.1 R36.2
TP_PACK: C33.1 NFET_driver.11(PACK) PACK+.1(TP) R42.1
TP_SCL: BQ.5(SCL) R45.2 SCL.1(TP) ; port SCL_uC
TP_SDA: BQ.4(SDA) R44.2 SDA.1(TP) ; port SDA_uC
TP_TS1: BQ.6(TS1) BQ_NTC.1 R43.2 TS1.1(TP)
NetBat_+_1: Bat_+.1 MOSFET1.3(S) MOSFET3.3(S) R31.1
NetBQ_7: BQ.7(CAP1) C37.1
NetBQ_17: BQ.17(VC0) C38.2 R50.1
NetBQ_18: BQ.18(SRP) C39.1 C40.2 R51.1
NetBQ_19: BQ.19(SRN) C40.1 C41.2 R52.1
NetBQ_20: BQ.20(ALERT) C_Alert.1 R_Alert.1 ; port Alert_uC
NetC28_1: C28.1 NFET_driver.1(VDDCP)
NetDiode1_1: Diode1.1 R37.2 R39.1
NetMOSFET1_1: MOSFET1.1(G) R32.2
NetMOSFET1_2: MOSFET1.2(D) MOSFET2.2(D) MOSFET3.2(D) MOSFET4.2(D)
NetMOSFET2_1: MOSFET2.1(G) R33.1
NetMOSFET2_3: MOSFET2.3(S) MOSFET4.3(S) Pack_+.1 R34.2 R42.2
NetMOSFET3_1: MOSFET3.1(G) R35.2
NetMOSFET4_1: MOSFET4.1(G) R36.1
NetNFET_driver_5: NFET_driver.5(CP_EN) ; port CP_EN_uC
NetNFET_driver_7: NFET_driver.7(PMON_EN) ; port PMON_EN_uC
NetNFET_driver_10: NFET_driver.10(PACKDIV) R48.2
NetPack_-_1: Pack_-.1 R52.2 R_Shunt_300uR.2
NetR43_1: R43.1 R54.1 ; port GPIO_Boot
NetR48_1: R48.1 R49.2 ; port PACKDIV_uC

Not connected (* = marked no-connect by the designer): BQ 11(NC); NFET_driver 3(NC) 13(NC) 14(PCHG)* 15(NC)

### Notes on the sheet
- High Side FET Driver
- (near R37) Analog Front End
- REGOUT : output 3.3V for uC
- But it's not stable so we don't use it
- (near R35) We use it to see whether BQ is working with LED
- BQ Activation (TS1)
- Two methods to boot BQ :
- 1. use Cell 1 Voltage, but TS1 would then always be high
- PMON_EN :
- Enable Pack + to be measure
- Since we have already used method 1 in Version, we would like to use method 2 in Version 2
- Therefore, please don't solder the jumper if you want to use method 2. The jumper connected
- with the cell 1 voltage is just for back up in case that the GPIO of uC is not funtional !!!!!
- 2. use GPIO output 3.3V to boot and close it after around 2mS, like using a switch
- PACKDIV :
- (near Pack_-) Send the Pack+ Voltage Signal to ADC in uC
- (near Bat_-) Comment
- We have 3 different names for Battery + (same V) :
- 1. Bat + : here flows most of the current, power supply for car
- 2. Bat_VCC : provide VCC for AFE and FET Driver
- (near TS1) 3. Cell_4_AFE : Voltage signal, which would be supervised from AFE
- with BMS feedback & BMS Wake up we could avoid that
- BMS is always on and battery discharges
- (in symbol Res Thermal) t?

### Library data of the parts
AFE_BAT CHG Driver_BAT DSG FET_CHG FET_DSG PACK+ SCL SDA TP_Cell_1-TP_Cell_4 TS1 = Test point
Bat_+ Bat_- Pack_+ Pack_- = 7461096: WP-SHFU Press-Fit with External thread, full plain, 7x7mm, 9 pins, M4x6mm, 130A; Pin Number: 9; Thread Length: 6mm; Thread: M4; Surface: Tin; ComponentLink1Description: Manufacturer; ComponentLink1URL: http://www.we-online.de; ComponentLink2Description: Datasheet; ComponentLink2URL: https://katalog.we-online.com/em/datasheet/7461096.pdf; Operating Temperature: -55 to +150degC; Height: 9mm; Material: Brass; Part Number: 7461096; Packaging: Bulk; Mounting Technology: Press-Fit; Rated Current: 130A; Publisher: Wurth Elektronik; Published Date: September 2019; Size: 7x7mm
BQ = BQ7692000PW: AFE Cell battery monitor; PartNumber: BQ7692000PWR; Manufacturer: Texas Instruments; RefDes: RefDes; Type: DEV; Value: Value; Copyright: Copyright (C) 2018 Accelerated Designs. All rights reserved
BQ_NTC = Res Thermal: Thermistor; Published: 24-Mar-1999; LatestRevisionDate: 29-May-2009; LatestRevisionNote: IPC-7351 Footprint Added.; PackageVersion: Mar-2003; PackageReference: 6-0805; Publisher: Altium Limited; PackageDescription: Chip Resistor 0805 Case Size; Code_IPC: RESC2012
C28-C41 C_Alert = Cap: Capacitor; Value: 220nF; Published: 8-Jun-2000; LatestRevisionDate: 17-Jul-2002; LatestRevisionNote: Re-released for DXP Platform.; PackageReference: RAD-0.3; Publisher: Altium Limited; PackageDescription: Radial Cap, Thru-Hole; 2 Leads; 0.3 in Pin Spacing
Diode1 = LL4148-GS08: No Description Available; Vendor: Vishay; Built_By: EMA_UL_Team; SourceLibrary: Vishay_2020-02-10; Manufacturer_Part_Number: LL4148-GS08; Copyright: Copyright (C) 2018 Accelerated Designs. All rights reserved; RefDes: RefDes; Type: DEV
MOSFET1-MOSFET4 = IRFS7430TRLPBF: No Description Available; Vendor: Infineon; Built_By: EMA_Cory; SourceLibrary: Infineon_2020-06-10; Datasheet: https://www.infineon.com/dgdl/Infineon-IRFS7430-DS-v01_00-EN.pdf?fileId=5546d462576f3475015792dbfbd6000d; Manufacturer_Part_Number: IRFS7430TRLPBF; Copyright: Copyright (C) 2018 Accelerated Designs. All rights reserved; RefDes: RefDes; Type: DEV
NFET_driver = BQ76200PW: high-side NFET driver; PartNumber: BQ76200PWR; Manufacturer: Texas Instruments; CompType: IC; PIN_COUNT: 16; Application_BuildNumber: *; Alternate_PartNumber: BQ76200PW; PackageReference: PW0016A; MountType: SMT; RoHS: Y; RefDes: RefDes; Type: DEV; Value: Value; Copyright: Copyright (C) 2018 Accelerated Designs. All rights reserved
R31-R38 R40-R42 R46-R52 R54 R_Alert = Res2: Resistor; Value: 10kR; Published: 8-Jun-2000; LatestRevisionDate: 17-Jul-2002; LatestRevisionNote: Re-released for DXP Platform.; PackageReference: AXIAL-0.4; Publisher: Altium Limited; PackageDescription: Axial Device, Thru-Hole; 2 Leads; 0.4 in Pin Spacing
R39 R43-R45 = Res2: Resistor; Published: 8-Jun-2000; LatestRevisionDate: 17-Jul-2002; LatestRevisionNote: Re-released for DXP Platform.; PackageReference: AXIAL-0.4; Publisher: Altium Limited; PackageDescription: Axial Device, Thru-Hole; 2 Leads; 0.4 in Pin Spacing; Value: 10kR
R_Shunt_300uR = LRMAP3920B-R0003FT: No Description Available; Vendor: Welwyn; Built_By: EMA_Anthony; SourceLibrary: Welwyn_2019-11-05; Copyright: Copyright (C) 2018 Accelerated Designs. All rights reserved; Manufacturer_Part_Number: LRMAP3920B-R0003FT; RefDes: RefDes; Type: DEV

## Nets that join several sheets
+3V3: Power_Supply Voltage (5 pins), Eingang_Ausgang Signal (C4.2 CAN_Transceiver.3), uC (16 pins), AFE_BQ-Chip (R44.1 R45.1)
Bat_GND: Eingang_Ausgang Signal (R14.1), uC (uC.64), AFE_BQ-Chip (R50.2)
Bat_VCC: Power_Supply Voltage (3.3V_Voltage_Regulator.1 C10.2 D1.2), Eingang_Ausgang Signal (D_feedback.2 P1.3 TP18.1), AFE_BQ-Chip (Diode1.2 R39.2 R40.1)
GND: Power_Supply Voltage (12 pins), Eingang_Ausgang Signal (21 pins), uC (27 pins), AFE_BQ-Chip (19 pins)
REGOUT +3.3V: Power_Supply Voltage (R23.1), AFE_BQ-Chip (BQ.8 C36.1)
V_REF: Power_Supply Voltage (5 pins), Eingang_Ausgang Signal (R9.2 R10.2 R11.2), uC (R27.1 R28.1)
Cell_1_AFE: Eingang_Ausgang Signal (R17.2 Signal.6), AFE_BQ-Chip (R47.2 R54.2)
Cell_2_Backup: Eingang_Ausgang Signal (R7.2 Signal.8), AFE_BQ-Chip (R46.2)
Cell_3_Backup: Eingang_Ausgang Signal (R15.2 Signal.10), AFE_BQ-Chip (R41.2)
Cell_4_Backup: Eingang_Ausgang Signal (R5.2 Signal.12), AFE_BQ-Chip (R38.2)
Cell_Temp_1: Eingang_Ausgang Signal (R9.1 Signal.7 T1.1), uC (uC.57)
Cell_Temp_2: Eingang_Ausgang Signal (R10.1 Signal.9 T2.1), uC (uC.59)
Cell_Temp_3: Eingang_Ausgang Signal (R11.1 Signal.11 T3.1), uC (uC.58)
NetBQ_20: uC (uC.16), AFE_BQ-Chip (BQ.20 C_Alert.1 R_Alert.1)
NetC1_uC_1: Eingang_Ausgang Signal (C1_uC.1 C9.2 R18.1), uC (uC.63)
NetC2_uC_1: Eingang_Ausgang Signal (C2_uC.1 C7.2 R8.1), uC (uC.60)
NetC3_uC_1: Eingang_Ausgang Signal (C3_uC.1 C8.2 R16.1), uC (uC.61)
NetC4_uC_1: Eingang_Ausgang Signal (C4_uC.1 C6.2 R6.1), uC (uC.62)
NetCAN_Transceiver_1: Eingang_Ausgang Signal (CAN_Transceiver.1), uC (uC.31)
NetCAN_Transceiver_4: Eingang_Ausgang Signal (CAN_Transceiver.4), uC (uC.28)
NetNFET_driver_5: uC (uC.21), AFE_BQ-Chip (NFET_driver.5)
NetNFET_driver_7: uC (uC.19), AFE_BQ-Chip (NFET_driver.7)
NetR43_1: uC (uC.17), AFE_BQ-Chip (R43.1 R54.1)
NetR48_1: uC (uC.9), AFE_BQ-Chip (R48.1 R49.2)
TP_SCL: uC (uC.23), AFE_BQ-Chip (BQ.5 R45.2 SCL.1)
TP_SDA: uC (uC.24), AFE_BQ-Chip (BQ.4 R44.2 SDA.1)